# Altium schematic sheet Page03 PWR TREE.SchDoc
size 513 x 386 mm; SheetNumber: 1; SheetTotal: 11
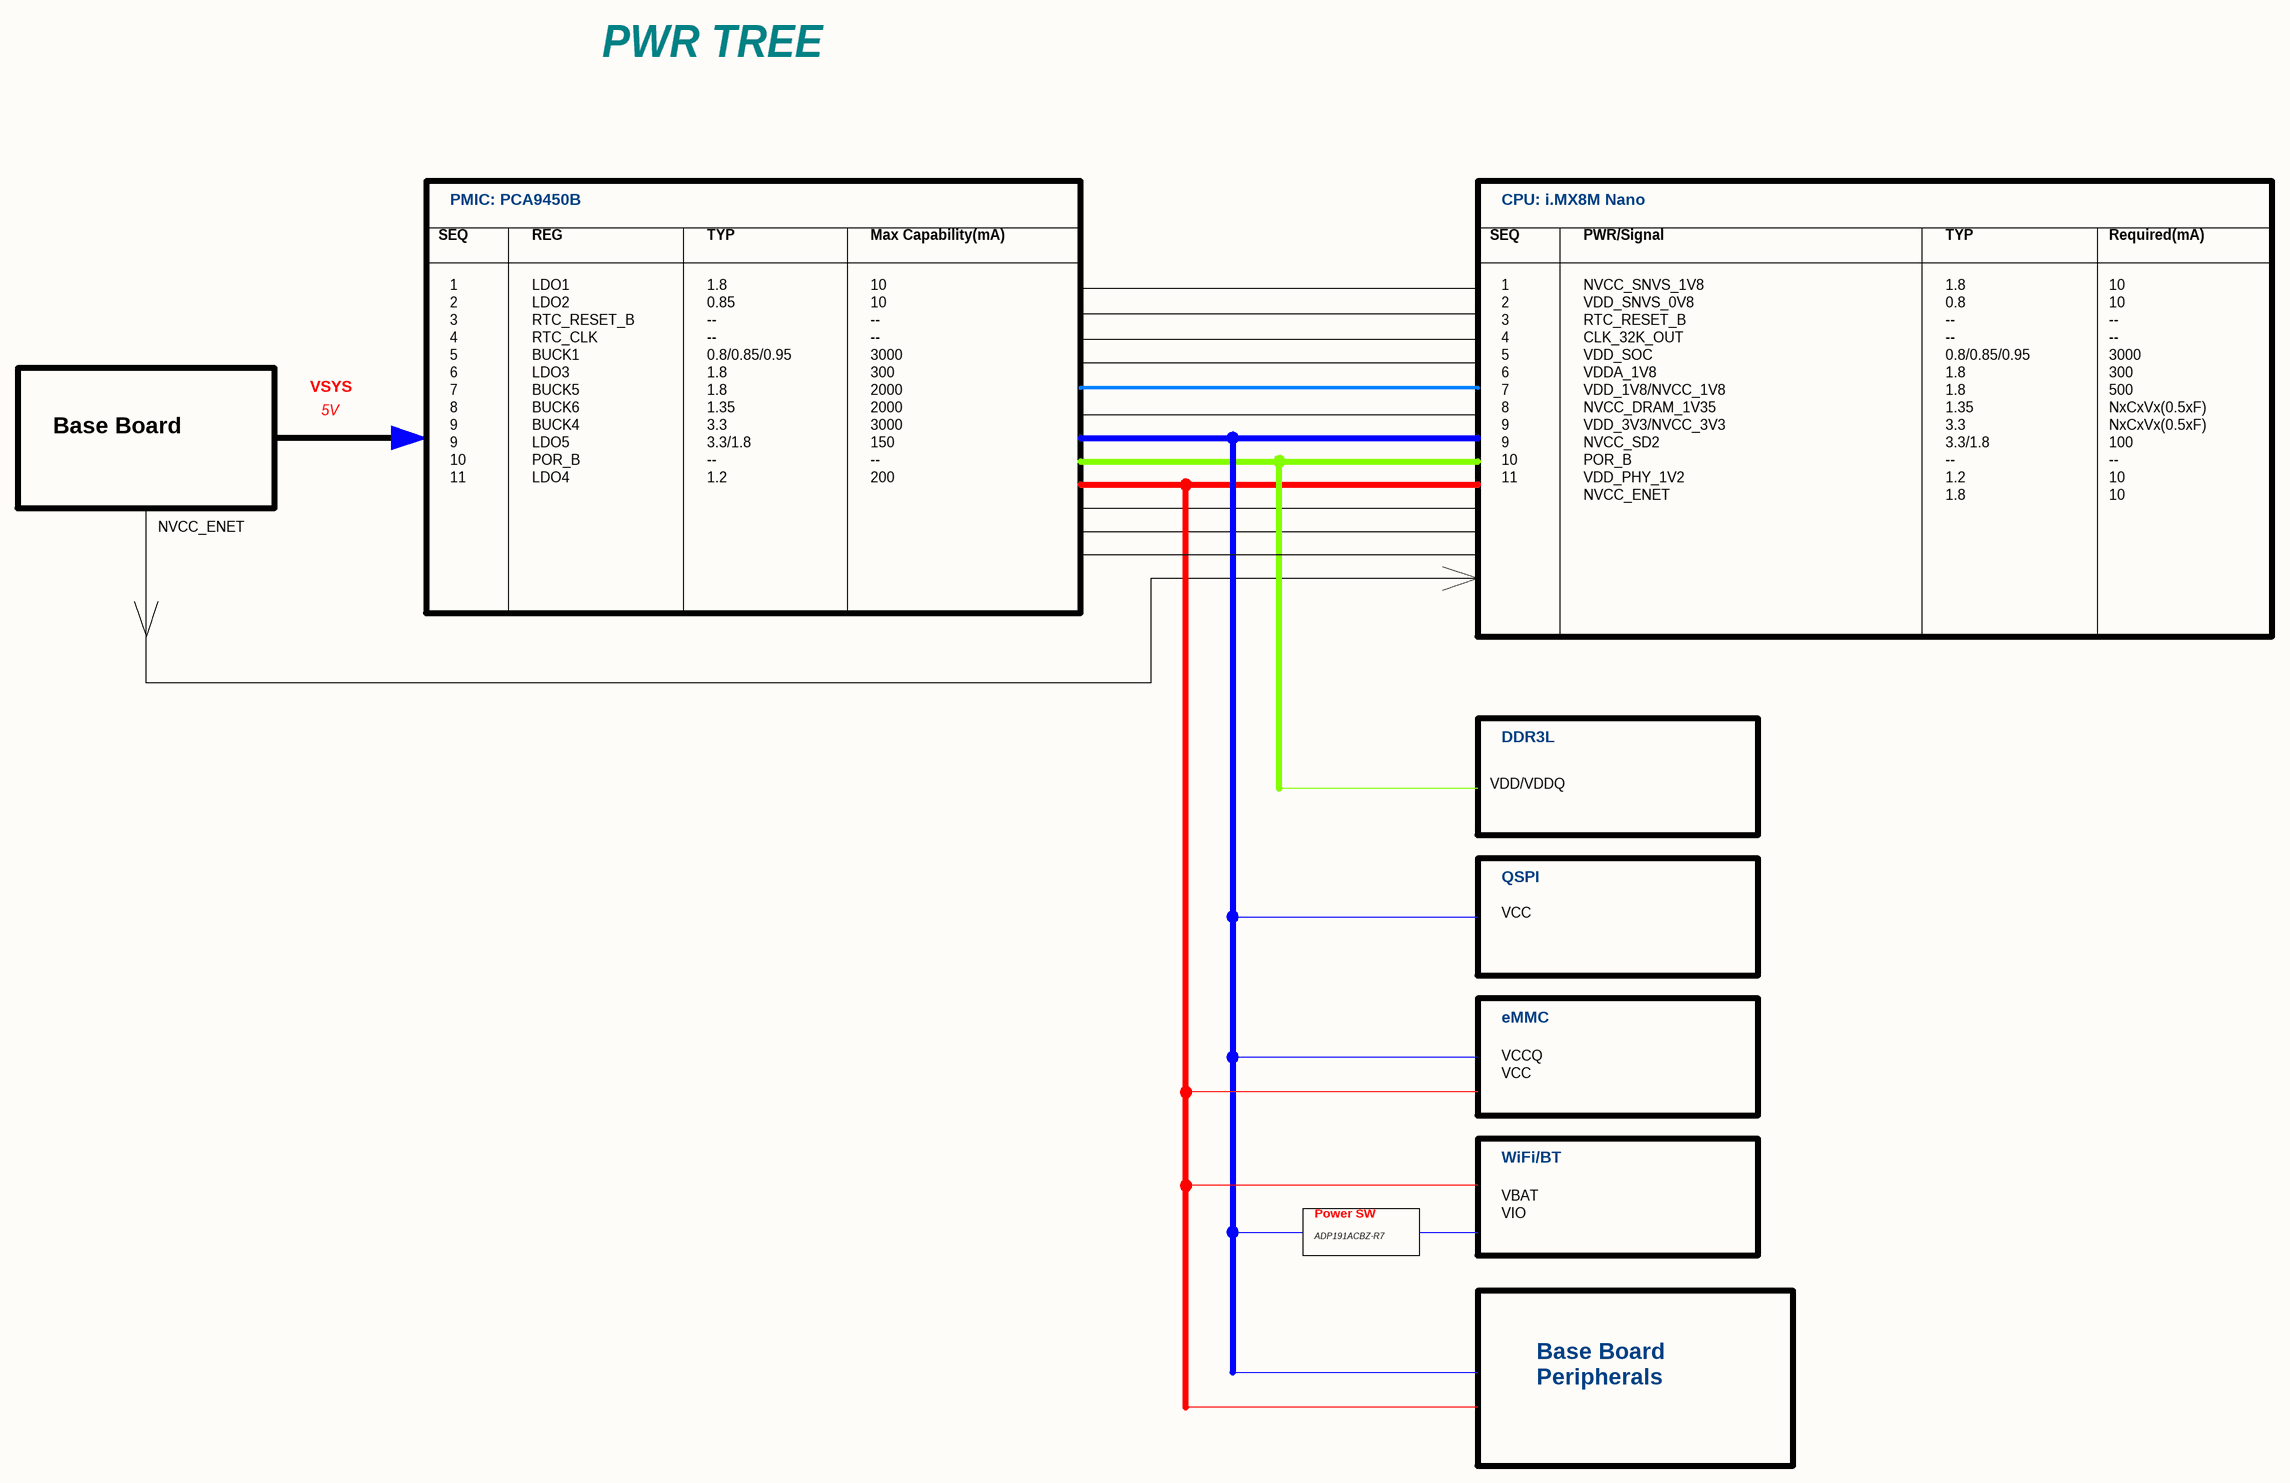
[diagram p0: Page03 PWR TREE.SchDoc]

## Notes on the sheet
- PWR TREE
- SEQ
- PMIC: PCA9450B
- REG
- TYP
- Max Capability(mA)
- CPU: i.MX8M Nano
- PWR/Signal
- Required(mA)
- VSYS
- Base Board
- 5V
- NVCC_ENET
- 1
  2
  3
  4
  5
  6
  7
  8
  9
  9
  10
  11
- LDO1
  LDO2
  RTC_RESET_B
  RTC_CLK
  BUCK1
  LDO3
  BUCK5
  BUCK6
  BUCK4
  LDO5
  POR_B
  LDO4
- 1.8
  0.85
  --
  --
  0.8/0.85/0.95
  1.8
  1.8
  1.35
  3.3
  3.3/1.8
  --
  1.2
- 10
  10
  --
  --
  3000
  300
  2000
  2000
  3000
  150
  --
  200
- NVCC_SNVS_1V8
  VDD_SNVS_0V8
  RTC_RESET_B
  CLK_32K_OUT
  VDD_SOC
  VDDA_1V8
  VDD_1V8/NVCC_1V8
  NVCC_DRAM_1V35
  VDD_3V3/NVCC_3V3
  NVCC_SD2
  POR_B
  VDD_PHY_1V2
  NVCC_ENET
- 1.8
  0.8
  --
  --
  0.8/0.85/0.95
  1.8
  1.8
  1.35
  3.3
  3.3/1.8
  --
  1.2
  1.8
- 10
  10
  --
  --
  3000
  300
  500
  NxCxVx(0.5xF)
  NxCxVx(0.5xF)
  100
  --
  10
  10
- DDR3L
- VDD/VDDQ
- VCC
- QSPI
- eMMC
- VCCQ
  VCC
- WiFi/BT
- Power SW
- VBAT
  VIO
- ADP191ACBZ-R7
- Base Board
  Peripherals